# Altium schematic sheet KASLI_CON.SchDoc
size 420 x 297 mm; SheetNumber: 3; SheetTotal: 11; ModifiedBy: -; CheckedDate: -; Title2: Title 2; DivGrp: WUT ISE; Designer: G.Kasprowicz
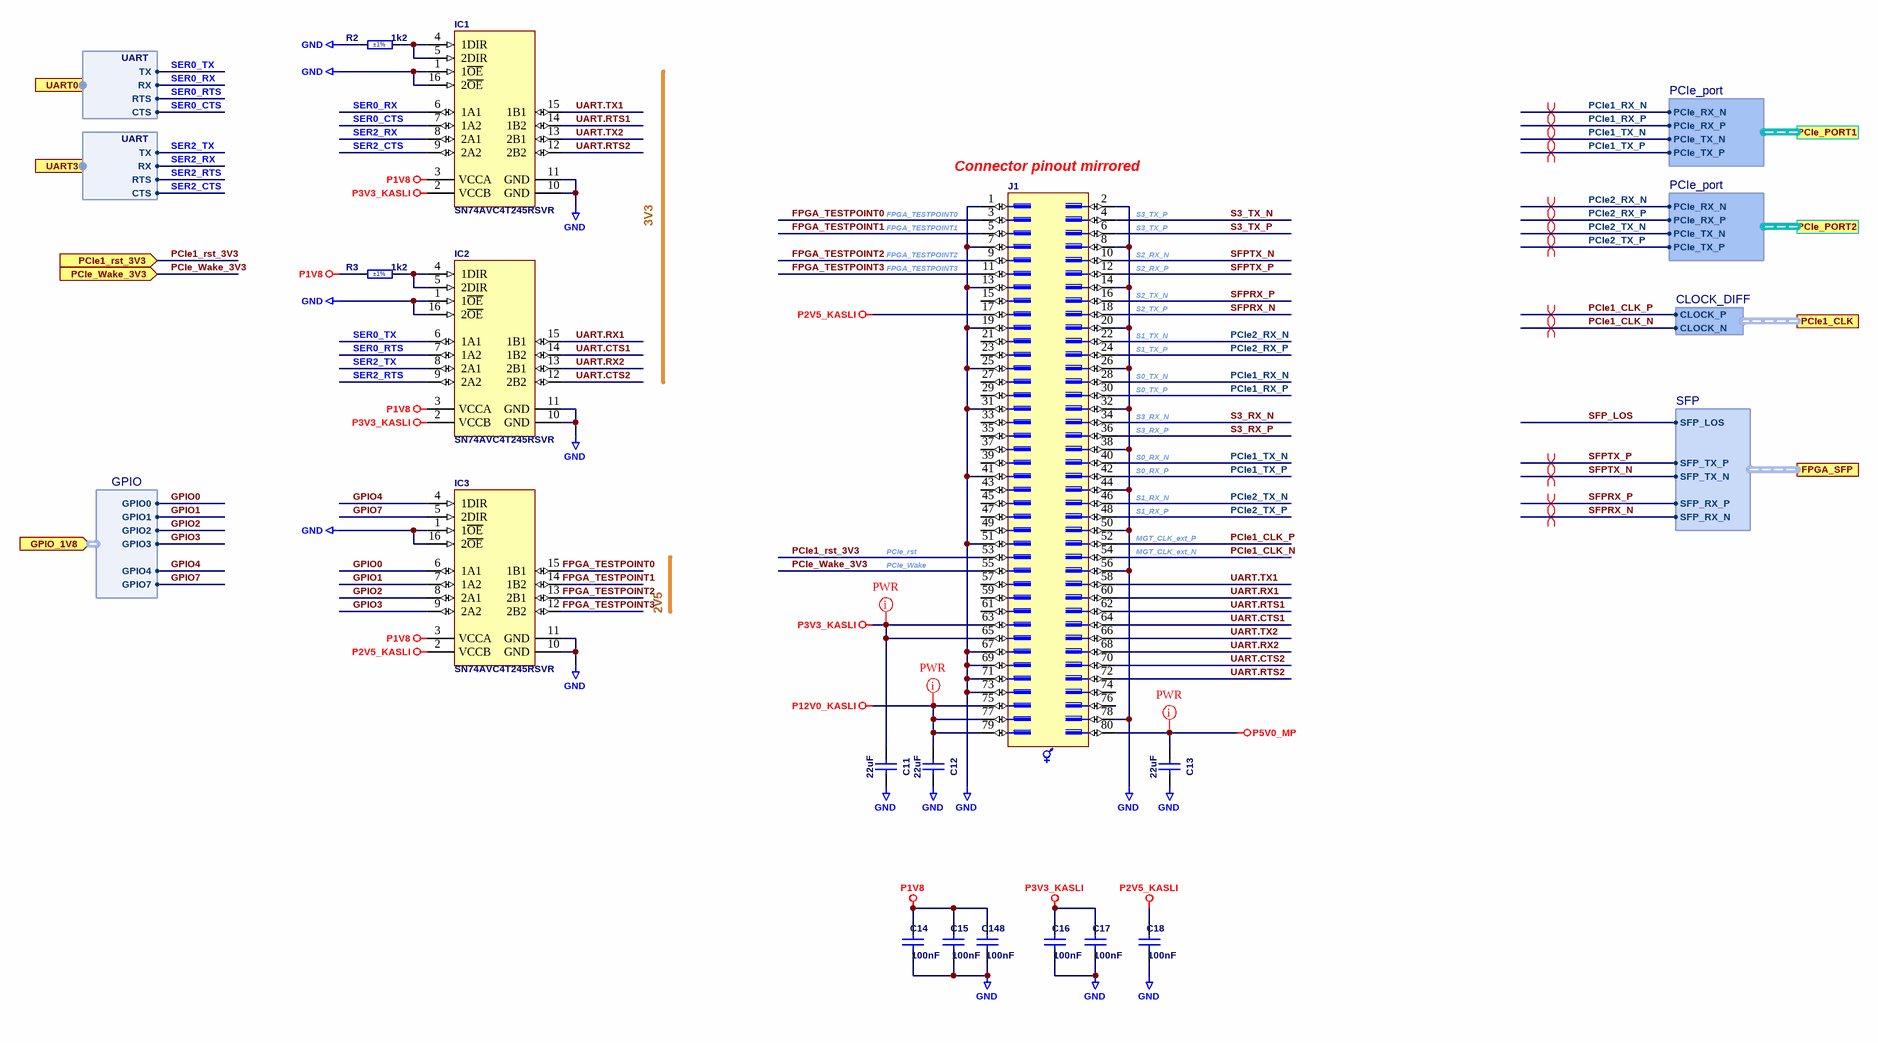
[diagram p0: KASLI_CON.SchDoc]

## Parts
C11  22uF  [CAPC2012X135N]
C12  22uF  [CAPC2012X135N]
C13  22uF  [CAPC2012X135N]
C14  100nF  [CAPC1005X55N]
C15  100nF  [CAPC1005X55N]
C16  100nF  [CAPC1005X55N]
C17  100nF  [CAPC1005X55N]
C18  100nF  [CAPC1005X55N]
C148  100nF  [CAPC1005X55N]
IC1  SN74AVC4T245RSVR  [QFN40P180X260X55-16N]
IC2  SN74AVC4T245RSVR  [QFN40P180X260X55-16N]
IC3  SN74AVC4T245RSVR  [QFN40P180X260X55-16N]
J1  (no value)  [SAMTEC_LSS-140-01-L-DV-A]
R2  1k2  Tolerance: ±1%  [RESC1005X40N]
R3  1k2  Tolerance: ±1%  [RESC1005X40N]

## Ports
FPGA_SFP (harness SFP), GPIO_1V8 (in, harness GPIO), PCIe1_CLK (harness CLOCK_DIFF), PCIe1_rst_3V3 (in), PCIe_PORT1 (harness PCIe_port), PCIe_PORT2 (harness PCIe_port), PCIe_Wake_3V3 (in), UART0 (harness UART), UART3 (harness UART)

## Harnesses
CLOCK_DIFF: CLOCK_P, CLOCK_N
PCIe_port: PCIe_TX_P, PCIe_TX_N, PCIe_RX_P, PCIe_RX_N
SFP: SFP_TX_P, SFP_TX_N, SFP_RX_P, SFP_RX_N, SFP_LOS
UART: TX, RX, RTS, CTS
GPIO: GPIO0, GPIO1, GPIO2, GPIO3, GPIO4, GPIO7

## Nets
GND: C11.1 C12.1 C13.1 C14.1 C15.1 C16.1 C17.1 C18.1 C148.1 IC1.1(1~{OE}) IC1.10(GND) IC1.11(GND) IC1.16(2~{OE}) IC2.1(1~{OE}) IC2.10(GND) IC2.11(GND) IC2.16(2~{OE}) IC3.1(1~{OE}) IC3.10(GND) IC3.11(GND) IC3.16(2~{OE}) J1.1 J1.2 J1.7 J1.8 J1.13 J1.14 J1.19 J1.20 J1.25 J1.26 J1.31 J1.32 J1.38 J1.41 J1.44 J1.50 J1.51 J1.56 J1.67 J1.69 J1.71 J1.73 J1.78 R2.1
P1V8: C14.2 C15.2 C148.2 IC1.3(VCCA) IC2.3(VCCA) IC3.3(VCCA) R3.1
P2V5_KASLI: C18.2 IC3.2(VCCB) J1.17
P3V3_KASLI: C11.2 C16.2 C17.2 IC1.2(VCCB) IC2.2(VCCB) J1.63 J1.65
P5V0_MP: C13.2 J1.80
P12V0_KASLI: C12.2 J1.75 J1.77 J1.79
FPGA_TESTPOINT0: IC3.15(1B1) J1.3
FPGA_TESTPOINT1: IC3.14(1B2) J1.5
FPGA_TESTPOINT2: IC3.13(2B1) J1.9
FPGA_TESTPOINT3: IC3.12(2B2) J1.11
GPIO0: IC3.6(1A1) ; port GPIO_1V8.GPIO0
GPIO1: IC3.7(1A2) ; port GPIO_1V8.GPIO1
GPIO2: IC3.8(2A1) ; port GPIO_1V8.GPIO2
GPIO3: IC3.9(2A2) ; port GPIO_1V8.GPIO3
GPIO4: IC3.4(1DIR) ; port GPIO_1V8.GPIO4
GPIO7: IC3.5(2DIR) ; port GPIO_1V8.GPIO7
PCIe1_CLK_N: J1.54 ; port PCIe1_CLK.CLOCK_N
PCIe1_CLK_P: J1.52 ; port PCIe1_CLK.CLOCK_P
PCIe1_rst_3V3: J1.53 ; port PCIe1_rst_3V3
PCIe1_RX_N: J1.28 ; port PCIe_PORT1.PCIe_RX_N
PCIe1_RX_P: J1.30 ; port PCIe_PORT1.PCIe_RX_P
PCIe1_TX_N: J1.40 ; port PCIe_PORT1.PCIe_TX_N
PCIe1_TX_P: J1.42 ; port PCIe_PORT1.PCIe_TX_P
PCIe2_RX_N: J1.22 ; port PCIe_PORT2.PCIe_RX_N
PCIe2_RX_P: J1.24 ; port PCIe_PORT2.PCIe_RX_P
PCIe2_TX_N: J1.46 ; port PCIe_PORT2.PCIe_TX_N
PCIe2_TX_P: J1.48 ; port PCIe_PORT2.PCIe_TX_P
PCIe_Wake_3V3: J1.55 ; port PCIe_Wake_3V3
S3_RX_N: J1.34
S3_RX_P: J1.36
S3_TX_N: J1.4
S3_TX_P: J1.6
SER0_CTS: IC1.7(1A2) ; port UART0.CTS
SER0_RTS: IC2.7(1A2) ; port UART0.RTS
SER0_RX: IC1.6(1A1) ; port UART0.RX
SER0_TX: IC2.6(1A1) ; port UART0.TX
SER2_CTS: IC1.9(2A2) ; port UART3.CTS
SER2_RTS: IC2.9(2A2) ; port UART3.RTS
SER2_RX: IC1.8(2A1) ; port UART3.RX
SER2_TX: IC2.8(2A1) ; port UART3.TX
SFP_LOS: port FPGA_SFP.SFP_LOS
SFPRX_N: J1.18 ; port FPGA_SFP.SFP_RX_N
SFPRX_P: J1.16 ; port FPGA_SFP.SFP_RX_P
SFPTX_N: J1.10 ; port FPGA_SFP.SFP_TX_N
SFPTX_P: J1.12 ; port FPGA_SFP.SFP_TX_P
UART.CTS1: IC2.14(1B2) J1.64
UART.CTS2: IC2.12(2B2) J1.70
UART.RTS1: IC1.14(1B2) J1.62
UART.RTS2: IC1.12(2B2) J1.72
UART.RX1: IC2.15(1B1) J1.60
UART.RX2: IC2.13(2B1) J1.68
UART.TX1: IC1.15(1B1) J1.58
UART.TX2: IC1.13(2B1) J1.66
NetIC1_4: IC1.4(1DIR) IC1.5(2DIR) R2.2
NetIC2_4: IC2.4(1DIR) IC2.5(2DIR) R3.2

Not connected (* = marked no-connect by the designer): J1 15 21 23 27 29 33 35 37 39 43 45 47 49 57 59 61 74 76

## Layout directives
differential pair: PCIe1_CLK_N, PCIe1_CLK_P, PCIe1_RX_N, PCIe1_RX_P, PCIe1_TX_N, PCIe1_TX_P, PCIe2_RX_N, PCIe2_RX_P, PCIe2_TX_N, PCIe2_TX_P, SFPRX_N, SFPRX_P, SFPTX_N, SFPTX_P
net class PWR: P3V3_KASLI, P5V0_MP, P12V0_KASLI

## Notes on the sheet
- (near J1) Connector pinout mirrored
- 3V3
- FPGA_TESTPOINT1
- FPGA_TESTPOINT0
- (near J1) S3_TX_P
- FPGA_TESTPOINT3
- FPGA_TESTPOINT2
- (near J1) S2_TX_N
- (near J1) S2_RX_P
- (near J1) S2_RX_N
- (near J1) S1_TX_P
- (near J1) S1_TX_N
- (near J1) S2_TX_P
- (near J1) S3_RX_P
- (near J1) S3_RX_N
- (near J1) S0_TX_P
- (near J1) S0_TX_N
- (near J1) S1_RX_N
- (near J1) S0_RX_P
- (near J1) S0_RX_N
- PCIe_rst
- PCIe_Wake
- (near J1) MGT_CLK_ext_N
- (near J1) MGT_CLK_ext_P
- (near J1) S1_RX_P
- 2V5
- Project/Equipment
- Document
- Designer
- Drawn by
- Check.by
- Copyright WUT ISE 2024.
  This documentation describes Open Hardware and is licensed under the CERN OHL v.2. You may redistribute and modify this documentation under the terms of the CERN OHL v.2. (http://ohwr.org/CERNOHL). This documentation is distributed WITHOUT ANY EXPRESS OR IMPLIED WARRANTY, INCLUDING OF MERCHANTABILITY, SATISFACTORY QUALITY AND FITNESS FOR A PARTICULAR PURPOSE. Please see the CERN OHL v.2 for applicable conditions.
- Contact
- File
- Last Mod.
- Print Date
- Sheet
- Size
- A3
- of
- Rev

## Library data of the parts
C11-C13 = CC0805_22UF_16V_10%_X5R: Non-polarised capacitor; Manufacturer: GENERIC; Part Description: SMD Multilayer Chip Ceramic Capacitor; Manufacturer1 Part Number: C2012X5R1C226KT; Tolerance: ±10%; Voltage: 16V; TC: X5R; Manufacturer Part Number: CC0805_22UF_16V_10%_X5R; Part Number: CC0805_22UF_16V_10%_X5R; Value: 22uF; Component Kind: Standard; Component Type: Standard; Pin Count: 2; Status: Preferred; Case: 0805; Mounted: Yes; Socket: No; SMD: Yes; Sense: No; Manufacturer1 Example: TDK; Manufacturer1 ComponentHeight: 1.35mm; HelpURL: \\cern.ch\dfs\Applications\Altium\Datasheets\CC0805_X5R_TDK_C.pdf; Author: CERN DEM JLC; CreateDate: 25.10.2012; LatestRevisionDate: 25.10.2012
C14-C18 C148 = CC0402_100NF_16V_10%_X7R: Non-polarised capacitor; Part Description: SMD Multilayer Chip Ceramic Capacitor; Manufacturer: GENERIC; Manufacturer1 Part Number: GRM155R71C104KA88D; Voltage: 16V; TC: X7R; Tolerance: ±10%; Part Number: CC0402_100NF_16V_10%_X7R; Component Kind: Standard; Component Type: Standard; Pin Count: 2; Value: 100nF; Status: Not Recommended; Manufacturer Part Number: CC0402_100NF_16V_10%_X7R; Case: 0402; Mounted: Yes; Socket: No; SMD: Yes; Sense: No; Manufacturer1 Example: MURATA; Manufacturer1 ComponentHeight: 0.55mm; HelpURL: \\cern.ch\dfs\Applications\Altium\Datasheets\CC0402_X7R_MURATA_GRM.pdf; Author: CERN DEM JLC; CreateDate: 05/12/2013; LatestRevisionDate: 03/12/2007
IC1-IC3 = SN74AVC4T245RSVR: 4-Bit Dual-Supply Bus Transceiver with Configurable Voltage Translation and 3-State Output; Part Description: 4-Bit Dual-Supply Bus Transceiver with Configurable Voltage Translation and 3-State Outputs; Manufacturer: TEXAS INSTRUMENTS; PressFit: No; Bonding: No; Part Number: SN74AVC4T245RSVR; Component Kind: Standard; Component Type: Standard; Device: SN74AVC4T245RSVR; PackageDescription: QFN, 0.40mm Pitch, Rect.; 16 Pin, 2.60mm L X 1.80mm W X 0.55mm H Body, IPC Medium Density; Status: Not Recommended; Manufacturer Part Number: SN74AVC4T245RSVR; Pin Count: 16; Case: QFN16; Mounted: Yes; Socket: No; SMD: Yes; Sense: No; ComponentHeight: 0.55mm; Author: CERN DEM JLC; HelpURL: \\cern.ch\dfs\Applications\Altium\Datasheets\SN74AVC4T245RSVR.pdf; CreateDate: 08.07.2014; LatestRevisionDate: 30.03.2017
J1 = SAMTEC_LSS-140-01-L-DV-A: Connector 80 Hermaphroditic; Part Description: 80 Contacts, Pitch 0.635mm, Razor Beam LSS Vertical High Speed Hermaphroditic Strip (Lead Style 4.5mm); Manufacturer: SAMTEC; PressFit: No; Part Number: SAMTEC_LSS-140-01-L-DV-A; Component Kind: Standard; Component Type: Standard; Pin Count: 80; Mounted: Yes; Socket: No; SMD: Yes; Sense: No; Status: None; Manufacturer Part Number: LSS-140-01-L-DV-A; ComponentHeight: 4.57mm; HelpURL: \\cern.ch\dfs\Applications\Altium\Datasheets\SAMTEC_LSS-140-01-L-DV-A.pdf; Author: CERN DEM JMW; CreateDate: 10.11.2015; LatestRevisionDate: 10.11.2015
R2 R3 = R0402_1K2_1%_0.0625W_100PPM: Resistor - 1%; Part Description: General Purpose Thick Film Chip Resistor; Manufacturer: GENERIC; Manufacturer 1: YAGEO PHYCOMP; Manufacturer 1 Part Number: 232270671202L; TC: ±100ppm/°C; PressFit: No; Part Number: R0402_1K2_1%_0.0625W_100PPM; Component Kind: Standard; Component Type: Standard; Pin Count: 2; Value: 1k2; Status: Not Recommended; Power: 0.0625W; Manufacturer Part Number: R0402_1K2_1%_0.0625W_100PPM; Case: 0402; Mounted: Yes; Sense: No; Socket: No; SMD: Yes; Manufacturer1 ComponentHeight: 0.4mm; HelpURL: \\cern.ch\dfs\Applications\Altium\Datasheets\R0402_Phycomp_RC0402.pdf; Author: CERN DEM JLC; CreateDate: 03.12.2007; LatestRevisionDate: 17.10.2012